# Altium project Final_Project.PrjPcb
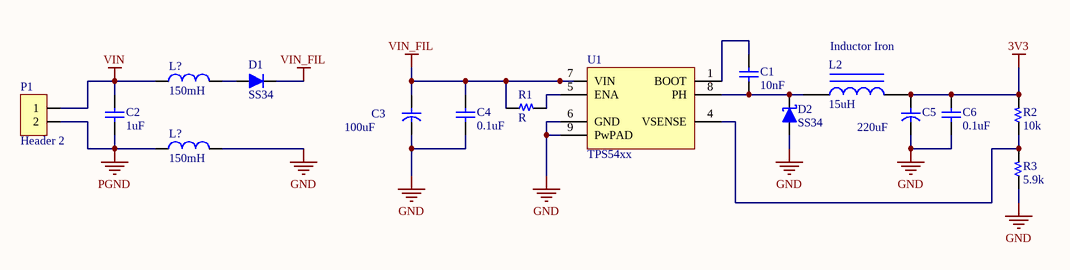
[diagram p0: 3.3V_Regulator.SchDoc]
7 sheets, 83 parts. Net scope: flat (ports and power ports of the same name join across sheets).
Board file: Main_Board.PcbDoc
Sheets:
  3.3V_Regulator.SchDoc
  ESP32_WROM_32.SchDoc
  Slide_Switch.SchDoc
  Current_Sensor_Circuit.SchDoc
  RS_485.SchDoc
  High_Current_LEDs.SchDoc
  IC_74HC595.SchDoc

## Sheet 3.3V_Regulator.SchDoc
size A; SheetNumber: 1; SheetTotal: 7

### Parts
(Parts that share a designator on the sheet are numbered #1, #2 ... from top to bottom, then left to right.)
C1  10nF  [C 0805]
C2  1uF  [C 0805]
C3  100uF  [C SMD TAN 1206 (A)]
C4  0.1uF  [C 0805]
C5  220uF  [C SMD TAN 1206 (A)]
C6  0.1uF  [C 0805]
D1  SS34  [DO-35 (SOD27 )]
D2  SS34  [DO-41]
L2  Inductor Iron  value 15uH  [Inductor SMD 0805 (2012)]
L?#1  150mH  [L/0.4]
L?#2  150mH  [L/0.4]
P1  Header 2  [HDR/Header/2]
R1  R  [R 0805]
R2  10k  [R 0805]
R3  5.9k  [R 0805]
U1  TPS54xx  [SOIC-8 EP]

### Nets
3V3: C5.1 C6.1 L2.2 R2.2
GND: C3.2 C4.2 C5.2 C6.2 D2.1(A) L?#2.2 R3.1 U1.6(GND) U1.9(PwPAD)
PGND: C2.1 L?#2.1 P1.2
VIN: C2.2 L?#1.1 P1.1
VIN_FIL: C3.1 C4.1 D1.2(K) R1.1 U1.7(VIN)
NetC1_1: C1.1 U1.1(BOOT)
NetC1_2: C1.2 D2.2(K) L2.1 U1.8(PH)
NetD1_1: D1.1(A) L?#1.2
NetR1_2: R1.2 U1.5(ENA)
NetR2_1: R2.1 R3.2 U1.4(VSENSE)

### Library data of the parts
C1 C2 C4 C6 = Capacitor NP: Capacitor non-pol
C3 C5 = Capacitor: Capacitor pol
D1 = Diode: Default Diode
D2 = Diode Schottky: Schottky Diode
L2 = Inductor Iron: Magnetic-Core Inductor; Published: 24-Mar-1999; LatestRevisionDate: 17-Jul-2002; LatestRevisionNote: Re-released for DXP Platform.; PackageReference: AXIAL-0.9; Publisher: Altium Limited; PackageDescription: Axial Device, Thru-Hole; 2 Leads; 0.9 in Pin Spacing
L?#1 L?#2 = L1: Inductor; Value: 150 mH
P1 = Header 2: Header, 2-Pin
R1-R3 = Resistor
U1 = TPS54xx: 3/5A, Wide input range, Step-down SWIFT DC-DC Converter

## Sheet ESP32_WROM_32.SchDoc
size A; SheetNumber: 2; SheetTotal: 7
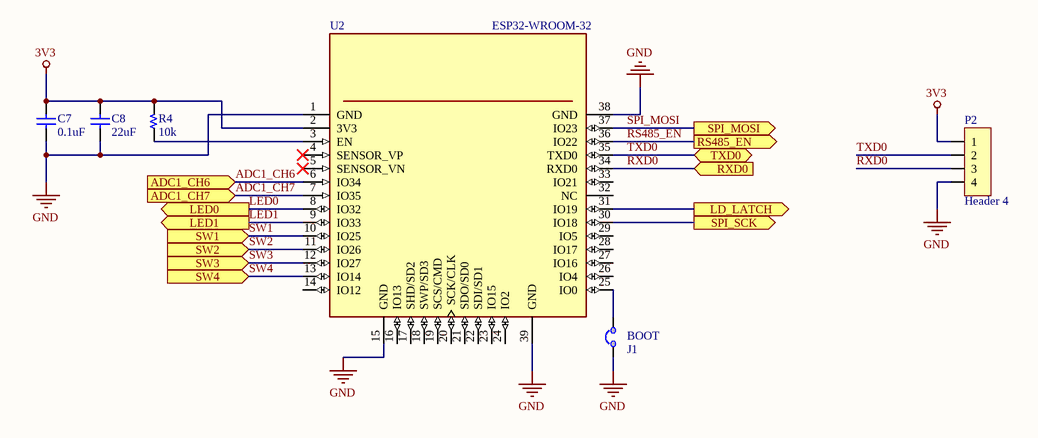
[diagram p1: ESP32_WROM_32.SchDoc]

### Parts
C7  0.1uF  [C 0805]
C8  22uF  [C 0805]
J1  BOOT  [JUMP/2/Close]  (no BOM)
P2  Header 4  [HDR/Header/4]
R4  10k  [R 0805]
U2  ESP32-WROOM-32  [MODULE_ESP32-WROOM-32]

### Ports
ADC1_CH6 (in, see Current_Sensor_Circuit[2A]), ADC1_CH7 (in, see Current_Sensor_Circuit[2A]), LD_LATCH (out, see IC_74HC595[1C]), LED0 (out, see High_Current_LEDs[1B]), LED1 (out, see High_Current_LEDs[2B]), RS485_EN (out, see RS_485[1B]), RXD0 (in, see RS_485[1B]), SPI_MOSI (out, see IC_74HC595[1C]), SPI_SCK (out, see IC_74HC595[1C]), SW1 (in, see Slide_Switch[3B]), SW2 (in, see Slide_Switch[3B]), SW3 (in, see Slide_Switch[3B]), SW4 (in, see Slide_Switch[3B]), TXD0 (bidir, see RS_485[1B])

### Nets
3V3: C7.1 C8.1 P2.1 R4.2 U2.2(3V3)
GND: C7.2 C8.2 J1.1 P2.4 U2.1(GND) U2.15(GND) U2.38(GND) U2.39(GND)
ADC1_CH6: U2.6(IO34) ; port ADC1_CH6
ADC1_CH7: U2.7(IO35) ; port ADC1_CH7
LD_LATCH: U2.31(IO19) ; port LD_LATCH
LED0: U2.8(IO32) ; port LED0
LED1: U2.9(IO33) ; port LED1
RS485_EN: U2.36(IO22) ; port RS485_EN
RXD0: P2.3 U2.34(RXD0) ; port RXD0
SPI_MOSI: U2.37(IO23) ; port SPI_MOSI
SPI_SCK: U2.30(IO18) ; port SPI_SCK
SW1: U2.10(IO25) ; port SW1
SW2: U2.11(IO26) ; port SW2
SW3: U2.12(IO27) ; port SW3
SW4: U2.13(IO14) ; port SW4
TXD0: P2.2 U2.35(TXD0) ; port TXD0
NetJ1_2: J1.2 U2.25(IO0)
NetR4_1: R4.1 U2.3(EN)

Not connected (* = marked no-connect by the designer): U2 4(SENSOR_VP)* 5(SENSOR_VN)* 14(IO12) 16(IO13) 17(SHD/SD2) 18(SWP/SD3) 19(SCS/CMD) 20(SCK/CLK) 21(SDO/SD0) 22(SDI/SD1) 23(IO15) 24(IO2) 26(IO4) 27(IO16) 28(IO17) 29(IO5) 32(NC) 33(IO21)

### Library data of the parts
C7 C8 = Capacitor NP: Capacitor non-pol
J1 = JUMP 2
P2 = Header 4: Header, 4-Pin
R4 = Resistor
U2 = ESP32-WROOM-32: Bluetooth, WiFi 802.11b/g/n, Bluetooth v4.2 + EDR, Class 1, 2 and 3 Transceiver Module 2.4GHz ~ 2.5GHz Integrated, Trace Surface Mount; MF: Espressif Systems; MP: ESP32-WROOM-32D; Price: None; Package: Module Espressif Systems; Availability: Unavailable; SnapEDA_Link: https://www.snapeda.com/parts/ESP32-WROOM-32D/Espressif%20Systems/view-part/2768115/?ref=snap; Value: *

## Sheet Slide_Switch.SchDoc
size A; SheetNumber: 3; SheetTotal: 7
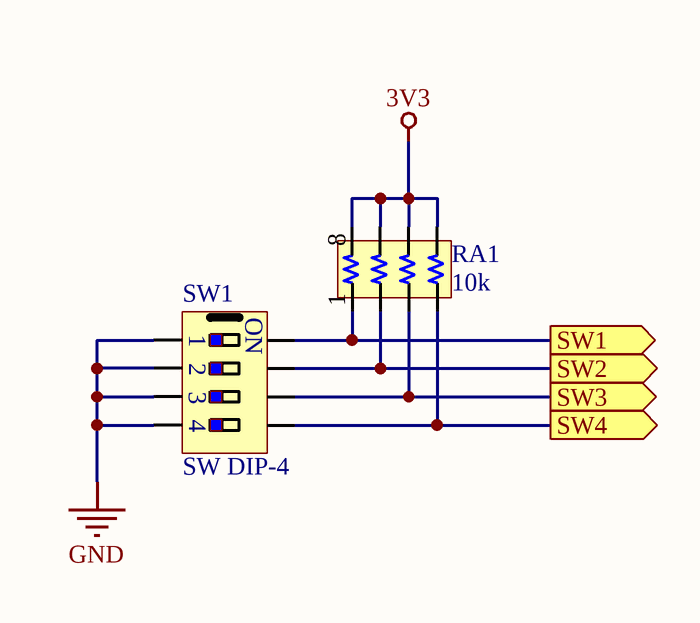
[diagram p2: Slide_Switch.SchDoc]

### Parts
RA1  10k  [RA4 1206 (3216)]
SW1  SW DIP-4  [SW/DIP4]

### Ports
SW1 (out, see ESP32_WROM_32[2B]), SW2 (out, see ESP32_WROM_32[2B]), SW3 (out, see ESP32_WROM_32[2B]), SW4 (out, see ESP32_WROM_32[2B])

### Nets
3V3: RA1.5 RA1.6 RA1.7 RA1.8
GND: SW1.1 SW1.2 SW1.3 SW1.4
SW1: RA1.1 SW1.8 ; port SW1
SW2: RA1.2 SW1.7 ; port SW2
SW3: RA1.3 SW1.6 ; port SW3
SW4: RA1.4 SW1.5 ; port SW4

### Notes on the sheet
- (in symbol SW DIP-4) ON

### Library data of the parts
RA1 = Resistor Array 4

## Sheet Current_Sensor_Circuit.SchDoc
size A; SheetNumber: 4; SheetTotal: 7
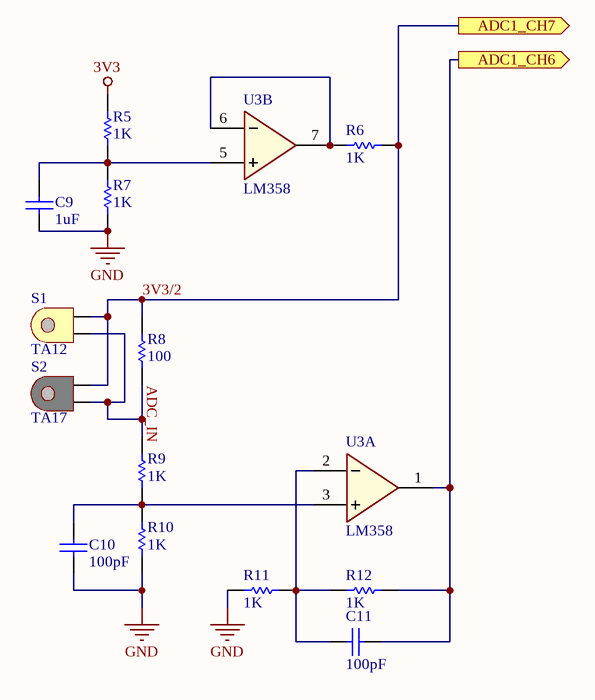
[diagram p3: Current_Sensor_Circuit.SchDoc]

### Parts
C9  value 1uF  (hidden comment: Capacitor)
C10  value 100pF  (hidden comment: Capacitor)
C11  value 100pF  (hidden comment: Capacitor)
R5  value 1K  (hidden comment: Resistor)
R6  value 1K  (hidden comment: Resistor)
R7  value 1K  (hidden comment: Resistor)
R8  value 100  (hidden comment: Resistor)
R9  value 1K  (hidden comment: Resistor)
R10  value 1K  (hidden comment: Resistor)
R11  value 1K  (hidden comment: Resistor)
R12  value 1K  (hidden comment: Resistor)
S1  TA12  [TA12]
S2  TA17  [TA17]
U3  LM358  [SOIC-8]  (parts A,B of 2)

### Ports
ADC1_CH6 (out, see ESP32_WROM_32[2B]), ADC1_CH7 (out, see ESP32_WROM_32[2B])

### Nets
3V3: R5.1
GND: C9.1 C10.1 R7.1 R10.1 R11.1 U3.4(GND)
VCC: U3.8(VCC)
ADC1_CH6: C11.2 R12.2 U3.1(OutA) ; port ADC1_CH6
ADC1_CH7: R6.2 R8.2 S1.2 S2.2 ; port ADC1_CH7
NetC9_2: C9.2 R5.2 R7.2 U3.5(B+)
NetC10_2: C10.2 R9.1 R10.2 U3.3(A+)
NetC11_1: C11.1 R11.2 R12.1 U3.2(A-)
NetR6_1: R6.1 U3.6(B-) U3.7(OutB)
NetR8_1: R8.1 R9.2 S1.1 S2.1

### Notes on the sheet
- (near R8) 3V3/2
- ADC_IN

### Library data of the parts
C9-C11 = Capacitor: SimulationGenericComponent: True
R5-R12 = Resistor: TC1: 0; SimulationGenericComponent: True; TC2: 0
U3 = LM358: Low Power Dual Operational Amplifiers

## Sheet RS_485.SchDoc
size A; SheetNumber: 5; SheetTotal: 7
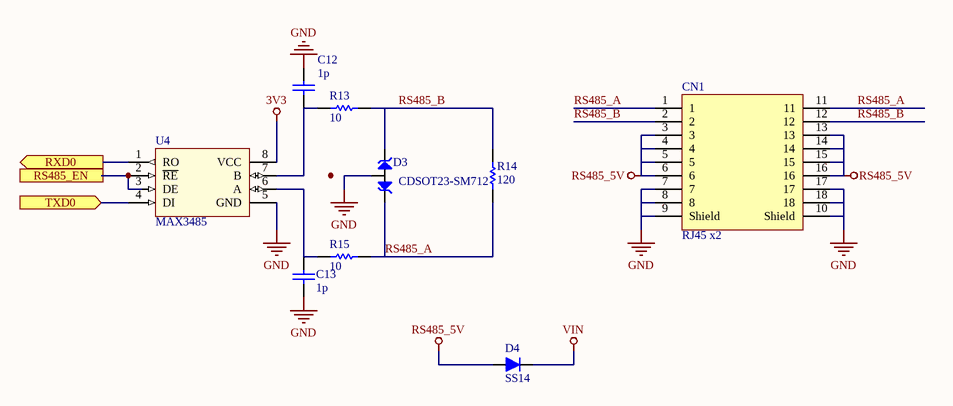
[diagram p4: RS_485.SchDoc]

### Parts
C12  value 1p  (hidden comment: Capacitor)
C13  value 1p  (hidden comment: Capacitor)
CN1  RJ45 x2  [CONN/RJ45/x2]
D3  CDSOT23-SM712  [SOT-23]
D4  SS14  [DO-35 (SOD27 )]
R13  value 10  (hidden comment: Resistor)
R14  value 120  (hidden comment: Resistor)
R15  value 10  (hidden comment: Resistor)
U4  MAX3485  [SOIC-8]

### Ports
RS485_EN (in, see ESP32_WROM_32[3B]), RXD0 (out, see ESP32_WROM_32[3B]), TXD0 (in, see ESP32_WROM_32[3B])

### Nets
3V3: U4.8(VCC)
GND: C12.2 C13.1 CN1.7 CN1.8 CN1.9(Shield) CN1.10(Shield) CN1.17 CN1.18 D3.3(COM) U4.5(GND)
RS485_5V: CN1.3 CN1.4 CN1.5 CN1.6 CN1.13 CN1.14 CN1.15 CN1.16 D4.1(A)
VIN: D4.2(K)
RS485_A: CN1.1 CN1.11 D3.1(IO1) R14.1 R15.2
RS485_B: CN1.2 CN1.12 D3.2(IO2) R13.2 R14.2
RS485_EN: U4.2(~{RE}) U4.3(DE) ; port RS485_EN
RXD0: U4.1(RO) ; port RXD0
TXD0: U4.4(DI) ; port TXD0
NetC12_1: C12.1 R13.1 U4.7(B)
NetC13_2: C13.2 R15.1 U4.6(A)

### Library data of the parts
C12 C13 = Capacitor: SimulationGenericComponent: True
CN1 = CON RJ45 x2: Connector RJ45 X2
D3 = CDSOT23-SM712: TVS DIODE 7V/12V 14V/26V SOT23-3
D4 = Diode: Default Diode
R13-R15 = Resistor: TC1: 0; SimulationGenericComponent: True; TC2: 0
U4 = MAX485: Low-Power, Slew-Rate-Limited  RS-485/RS-422 Transceivers

## Sheet High_Current_LEDs.SchDoc
size A; SheetNumber: 6; SheetTotal: 7
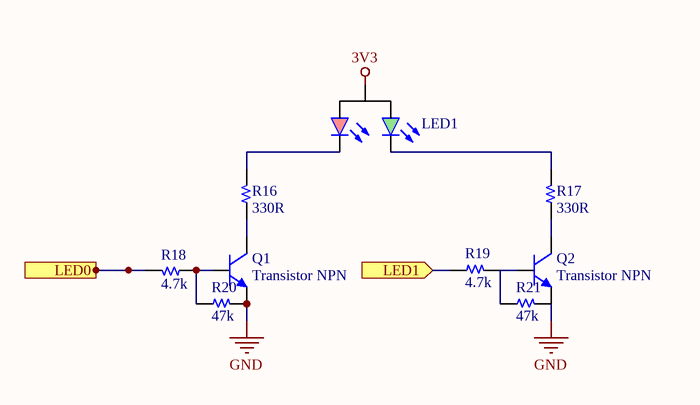
[diagram p5: High_Current_LEDs.SchDoc]

### Parts
LED1  Led 3pin 2color  [LED 3PIN 2COLOR 5MM]  (value not drawn)
Q1  Transistor NPN  [SOT-23]
Q2  Transistor NPN  [SOT-23]
R16  330R  [R 0805]
R17  330R  [R 0805]
R18  4.7k  [R 0805]
R19  4.7k  [R 0805]
R20  47k  [R 0805]
R21  47k  [R 0805]

### Ports
LED0 (in, see ESP32_WROM_32[2B]), LED1 (in, see ESP32_WROM_32[2B])

### Nets
3V3: LED1.2(A)
GND: Q1.2(E) Q2.2(E) R20.2 R21.2
LED0: R18.2 ; port LED0
LED1: R19.1 ; port LED1
NetLED1_1: LED1.1(RK) R16.2
NetLED1_3: LED1.3(YK) R17.2
NetQ1_1: Q1.1(B) R18.1 R20.1
NetQ1_3: Q1.3(C) R16.1
NetQ2_1: Q2.1(B) R19.2 R21.1
NetQ2_3: Q2.3(C) R17.1

### Library data of the parts
LED1 = Led 3pin 2color: Typical LED 3-pin 2-color
Q1 Q2 = Transistor NPN: NPN Bipolar Transistor
R16-R21 = Resistor

## Sheet IC_74HC595.SchDoc
size A; SheetNumber: 7; SheetTotal: 7
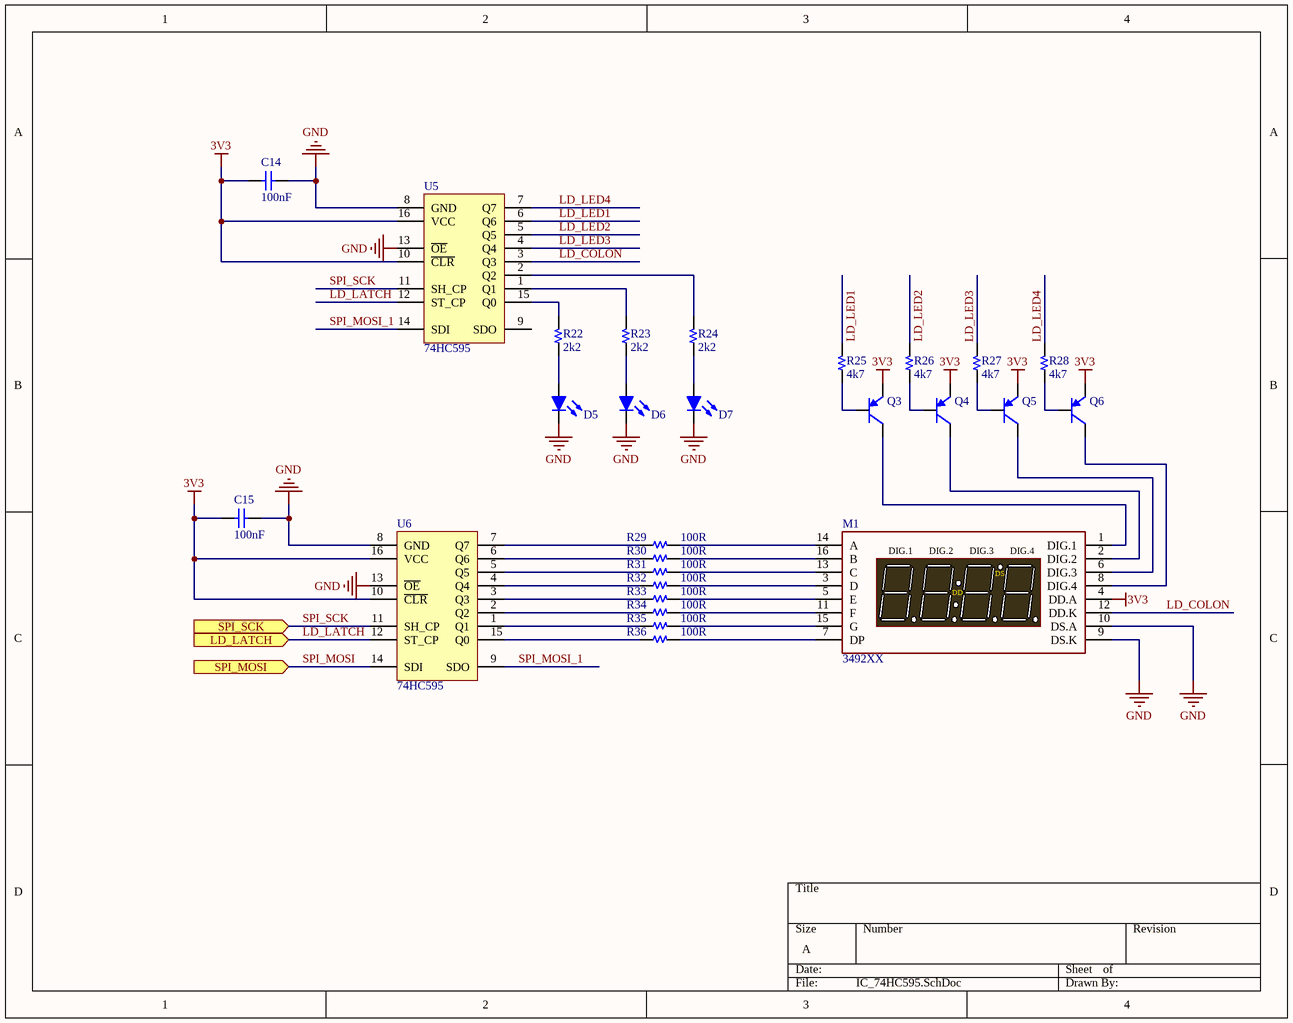
[diagram p6: IC_74HC595.SchDoc]

### Parts
C14  100nF  [C 0805]
C15  100nF  [C 0805]
D5  Led  [Led 0805]  (value not drawn)
D6  Led  [Led 0805]  (value not drawn)
D7  Led  [Led 0805]  (value not drawn)
M1  3492XX  [LED 7-SEG X4 3492XX]
Q3  Transistor PNP  [SOT-23]  (value not drawn)
Q4  Transistor PNP  [SOT-23]  (value not drawn)
Q5  Transistor PNP  [SOT-23]  (value not drawn)
Q6  Transistor PNP  [SOT-23]  (value not drawn)
R22  2k2  [R 0805]
R23  2k2  [R 0805]
R24  2k2  [R 0805]
R25  4k7  [R 0805]
R26  4k7  [R 0805]
R27  4k7  [R 0805]
R28  4k7  [R 0805]
R29  100R  [R 0805]
R30  100R  [R 0805]
R31  100R  [R 0805]
R32  100R  [R 0805]
R33  100R  [R 0805]
R34  100R  [R 0805]
R35  100R  [R 0805]
R36  100R  [R 0805]
U5  74HC595  [SOIC-16]
U6  74HC595  [SOIC-16]

### Ports
LD_LATCH (in, see ESP32_WROM_32[3A]), SPI_MOSI (in, see ESP32_WROM_32[2C]), SPI_SCK (in, see ESP32_WROM_32[3B])

### Nets
3V3: C14.1 C15.1 M1.4(DD.A) Q3.2(E) Q4.2(E) Q5.2(E) Q6.2(E) U5.10(~{CLR}) U5.16(VCC) U6.10(~{CLR}) U6.16(VCC)
GND: C14.2 C15.2 D5.2(K) D6.2(K) D7.2(K) M1.9(DS.K) M1.10(DS.A) U5.8(GND) U5.13(~{OE}) U6.8(GND) U6.13(~{OE})
LD_COLON: M1.12(DD.K) U5.3(Q3)
LD_LATCH: U5.12(ST_CP) U6.12(ST_CP) ; port LD_LATCH
LD_LED1: R25.2 U5.6(Q6)
LD_LED2: R26.2 U5.5(Q5)
LD_LED3: R27.2 U5.4(Q4)
LD_LED4: R28.2 U5.7(Q7)
SPI_MOSI: U6.14(SDI) ; port SPI_MOSI
SPI_MOSI_1: U5.14(SDI) U6.9(SDO)
SPI_SCK: U5.11(SH_CP) U6.11(SH_CP) ; port SPI_SCK
NetD5_1: D5.1(A) R22.1
NetD6_1: D6.1(A) R23.1
NetD7_1: D7.1(A) R24.1
NetM1_1: M1.1(DIG.1) Q3.3(C)
NetM1_2: M1.2(DIG.2) Q4.3(C)
NetM1_3: M1.3(D) R32.2
NetM1_5: M1.5(E) R33.2
NetM1_6: M1.6(DIG.3) Q5.3(C)
NetM1_7: M1.7(DP) R36.2
NetM1_8: M1.8(DIG.4) Q6.3(C)
NetM1_11: M1.11(F) R34.2
NetM1_13: M1.13(C) R31.2
NetM1_14: M1.14(A) R29.2
NetM1_15: M1.15(G) R35.2
NetM1_16: M1.16(B) R30.2
NetQ3_1: Q3.1(B) R25.1
NetQ4_1: Q4.1(B) R26.1
NetQ5_1: Q5.1(B) R27.1
NetQ6_1: Q6.1(B) R28.1
NetR22_2: R22.2 U5.15(Q0)
NetR23_2: R23.2 U5.1(Q1)
NetR24_2: R24.2 U5.2(Q2)
NetR29_1: R29.1 U6.7(Q7)
NetR30_1: R30.1 U6.6(Q6)
NetR31_1: R31.1 U6.5(Q5)
NetR32_1: R32.1 U6.4(Q4)
NetR33_1: R33.1 U6.3(Q3)
NetR34_1: R34.1 U6.2(Q2)
NetR35_1: R35.1 U6.1(Q1)
NetR36_1: R36.1 U6.15(Q0)

Not connected (* = marked no-connect by the designer): U5 9(SDO)

### Notes on the sheet
- (in symbol LED 7-SEG X4 3492) DS; DD

### Library data of the parts
C14 C15 = Capacitor NP: Capacitor non-pol
D5-D7 = Led: Typical LED
M1 = LED 7-SEG X4 3492: LED 7-seg x4 HDSP-B09G
Q3-Q6 = Transistor PNP: PNP Bipolar Transistor
R22-R36 = Resistor
U5 U6 = 74HC595: 8-bit serial-in, serial or parallel-out  shift register with output latches;  3-state

## Nets that join several sheets
3V3: 3.3V_Regulator (C5.1 C6.1 L2.2 R2.2), ESP32_WROM_32 (5 pins), Slide_Switch (RA1.5 RA1.6 RA1.7 RA1.8), Current_Sensor_Circuit (R5.1), RS_485 (U4.8), High_Current_LEDs (LED1.2), IC_74HC595 (11 pins)
GND: 3.3V_Regulator (9 pins), ESP32_WROM_32 (8 pins), Slide_Switch (SW1.1 SW1.2 SW1.3 SW1.4), Current_Sensor_Circuit (6 pins), RS_485 (10 pins), High_Current_LEDs (Q1.2 Q2.2 R20.2 R21.2), IC_74HC595 (11 pins)
VIN: 3.3V_Regulator (C2.2 L?#1.1 P1.1), RS_485 (D4.2)
ADC1_CH6: ESP32_WROM_32 (U2.6), Current_Sensor_Circuit (C11.2 R12.2 U3.1)
ADC1_CH7: ESP32_WROM_32 (U2.7), Current_Sensor_Circuit (R6.2 R8.2 S1.2 S2.2)
LD_LATCH: ESP32_WROM_32 (U2.31), IC_74HC595 (U5.12 U6.12)
LED0: ESP32_WROM_32 (U2.8), High_Current_LEDs (R18.2)
LED1: ESP32_WROM_32 (U2.9), High_Current_LEDs (R19.1)
RS485_EN: ESP32_WROM_32 (U2.36), RS_485 (U4.2 U4.3)
RXD0: ESP32_WROM_32 (P2.3 U2.34), RS_485 (U4.1)
SPI_MOSI: ESP32_WROM_32 (U2.37), IC_74HC595 (U6.14)
SPI_SCK: ESP32_WROM_32 (U2.30), IC_74HC595 (U5.11 U6.11)
SW1: ESP32_WROM_32 (U2.10), Slide_Switch (RA1.1 SW1.8)
SW2: ESP32_WROM_32 (U2.11), Slide_Switch (RA1.2 SW1.7)
SW3: ESP32_WROM_32 (U2.12), Slide_Switch (RA1.3 SW1.6)
SW4: ESP32_WROM_32 (U2.13), Slide_Switch (RA1.4 SW1.5)
TXD0: ESP32_WROM_32 (P2.2 U2.35), RS_485 (U4.4)